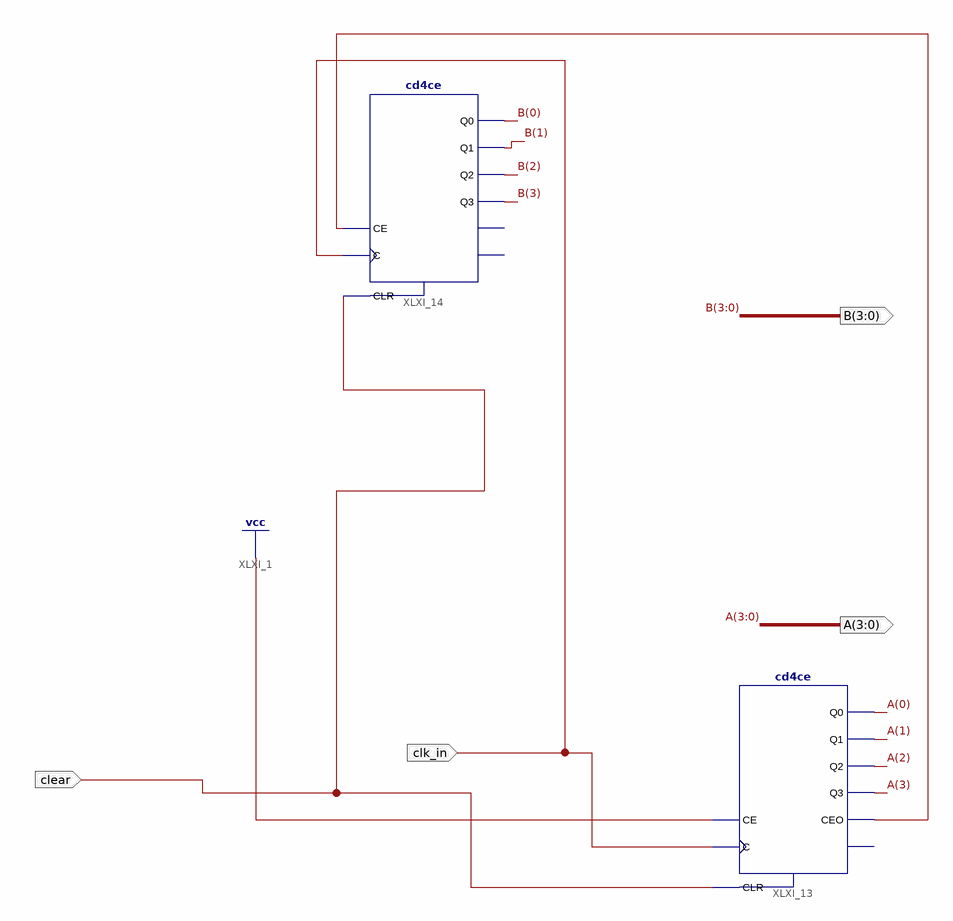
[diagram p0: schematic sheet 1]
// Xilinx ISE schematic min_counter.sch (spartan6) as structural Verilog: 2 symbols, 4 ports
module min_counter (
  input  clk_in,
  input  clear,
  output [3:0] A,
  output [3:0] B
);

  wire XLXN_55;

  cd4ce XLXI_13 (
    .C(clk_in), .CE(1'b1), .CLR(clear), .CEO(XLXN_55), .Q0(A[0]), .Q1(A[1]), .Q2(A[2]), .Q3(A[3]));  // open: TC
  cd4ce XLXI_14 (.C(clk_in), .CE(XLXN_55), .CLR(clear), .Q0(B[0]), .Q1(B[1]), .Q2(B[2]), .Q3(B[3]));  // open: CEO, TC
endmodule
